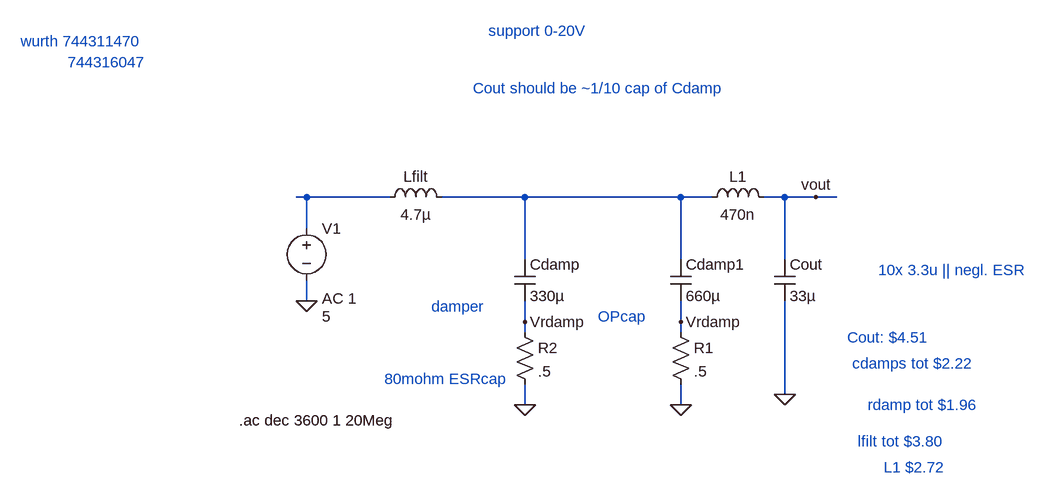
[diagram p0: schematic filtering.asc]
filtering.asc, the LTspice schematic file:
Version 4
SHEET 1 968 704
WIRE -288 272 -304 272
WIRE -160 272 -288 272
WIRE 48 272 -80 272
WIRE 288 272 48 272
WIRE 336 272 288 272
WIRE 448 272 416 272
WIRE 496 272 448 272
WIRE 528 272 496 272
WIRE -288 320 -288 272
WIRE 48 368 48 272
WIRE 288 368 288 272
WIRE 448 368 448 272
WIRE -288 432 -288 400
WIRE 48 464 48 432
WIRE 288 464 288 432
WIRE 48 480 48 464
WIRE 288 480 288 464
WIRE 448 576 448 432
WIRE 48 592 48 560
WIRE 288 592 288 560
FLAG 48 592 0
FLAG 448 576 0
FLAG -288 432 0
FLAG 48 464 Vrdamp
FLAG 288 592 0
FLAG 288 464 Vrdamp
FLAG 496 272 vout
SYMBOL ind -176 288 R270
WINDOW 0 32 56 VTop 2
WINDOW 3 5 56 VBottom 2
SYMATTR InstName Lfilt
SYMATTR Value 4.7µ
SYMATTR SpiceLine Rser=19.5m Cpar=4.948p
SYMBOL cap 32 368 R0
SYMATTR InstName Cdamp
SYMATTR Value 330µ
SYMATTR SpiceLine Rser=80m
SYMBOL cap 432 368 R0
SYMATTR InstName Cout
SYMATTR Value 33µ
SYMBOL voltage -288 304 R0
WINDOW 3 24 152 Left 2
WINDOW 123 24 124 Left 2
WINDOW 39 0 0 Left 0
SYMATTR Value 5
SYMATTR Value2 AC 1
SYMATTR InstName V1
SYMBOL res 32 464 R0
SYMATTR InstName R2
SYMATTR Value .5
SYMBOL cap 272 368 R0
SYMATTR InstName Cdamp1
SYMATTR Value 660µ
SYMATTR SpiceLine Rser=40m
SYMBOL res 272 464 R0
SYMATTR InstName R1
SYMATTR Value .5
SYMBOL ind 320 288 R270
WINDOW 0 32 56 VTop 2
WINDOW 3 5 56 VBottom 2
SYMATTR InstName L1
SYMATTR Value 470n
SYMATTR SpiceLine Rser=2.75m
TEXT -8 16 Left 2 ;support 0-20V
TEXT -96 440 Left 2 ;damper
TEXT 160 456 Left 2 ;OPcap
TEXT -32 104 Left 2 ;Cout should be ~1/10 cap of Cdamp
TEXT -392 616 Left 2 !.ac dec 3600 1 20Meg
TEXT -728 32 Left 2 ;wurth 744311470
TEXT -168 552 Left 2 ;80mohm ESRcap
TEXT 592 384 Left 2 ;10x 3.3u || negl. ESR
TEXT 544 488 Left 2 ;Cout: $4.51
TEXT 552 528 Left 2 ;cdamps tot $2.22
TEXT 576 592 Left 2 ;rdamp tot $1.96
TEXT 560 648 Left 2 ;lfilt tot $3.80
TEXT 600 688 Left 2 ;L1 $2.72
TEXT -656 64 Left 2 ;744316047

The netlist it stands for:
* filtering.asc
Lfilt N001 N002 4.7µ Rser=19.5m Cpar=4.948p
Cdamp N002 Vrdamp 330µ Rser=80m
Cout vout 0 33µ
V1 N001 0 5 AC 1
R2 Vrdamp 0 .5
Cdamp1 N002 Vrdamp 660µ Rser=40m
R1 Vrdamp 0 .5
L1 N002 vout 470n Rser=2.75m
* support 0-20V
* damper
* OPcap
* Cout should be ~1/10 cap of Cdamp
.ac dec 3600 1 20Meg
* wurth 744311470
* 80mohm ESRcap
* 10x 3.3u || negl. ESR
* Cout: $4.51
* cdamps tot $2.22
* rdamp tot $1.96
* lfilt tot $3.80
* L1 $2.72
* 744316047
.backanno
.end